# Altium project ET-COM.PrjPCB
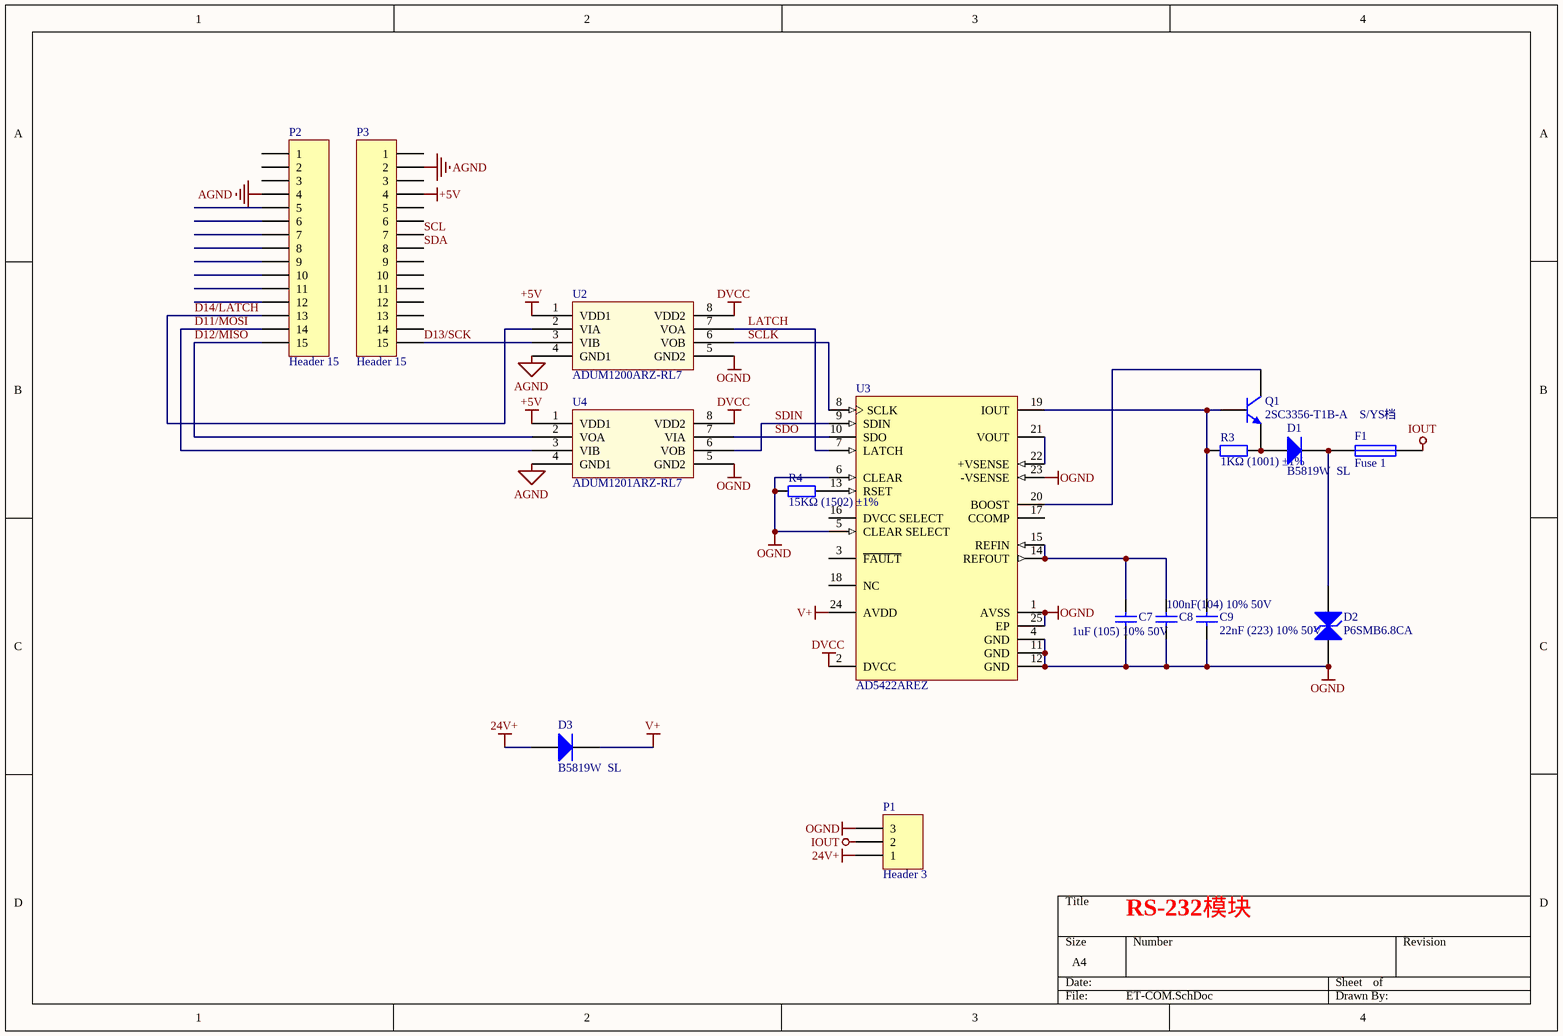
[diagram p0: ET-COM.SchDoc]
1 sheet, 16 parts. Net scope: global (net labels, ports and power ports of the same name join across sheets).
Board file: ET-COM.PcbDoc

## Sheet ET-COM.SchDoc
size A4

### Parts
C7  1uF (105) 10% 50V  [LC-0805_C]
C8  100nF(104) 10% 50V  [LC-0805_C]
C9  22nF (223) 10% 50V  [LC-0805_C]
D1  B5819W  SL  [LC-SOD-123]
D2  P6SMB6.8CA  [LC-SMB(DO-214AA)_S1]
D3  B5819W  SL  [SOD-123]
F1  Fuse 1  [LC-1206_L]
P1  Header 3  [connector_x3]
P2  Header 15  [HDR1X15]
P3  Header 15  [HDR1X15]
Q1  2SC3356-T1B-A    S/YS档  [LC-SOT-23(SOT-23-3)]
R3  1KΩ (1001) ±1%  [LC-0805_R]
R4  15KΩ (1502) ±1%  [LC-0805_R]
U2  ADUM1200ARZ-RL7  [LC-SOIC-8_150mil]
U3  AD5422AREZ  [RE-24_N]
U4  ADUM1201ARZ-RL7  [LC-SOIC-8_150mil]

### Nets
24V+: D3.1(A) P1.1
+5V: P3.4 U2.1(VDD1) U4.1(VDD1)
AGND: P2.4 P3.2 U2.4(GND1) U4.4(GND1)
DVCC: U2.8(VDD2) U3.2(DVCC) U4.8(VDD2)
IOUT: F1.2 P1.2
OGND: C7.1 C8.1 C9.1 D2.1(A) P1.3 R4.1 U2.5(GND2) U3.1(AVSS) U3.4(GND) U3.5(CLEAR_SELECT) U3.6(CLEAR) U3.11(GND) U3.12(GND) U3.23(-VSENSE) U3.25(EP) U4.5(GND2)
V+: D3.2(K) U3.24(AVDD)
D11/MOSI: P2.14 U4.3(VIB)
D12/MISO: P2.15 U4.2(VOA)
D13/SCK: P3.15 U2.3(VIB)
D14/LATCH: P2.13 U2.2(VIA)
LATCH: U2.7(VOA) U3.7(LATCH)
SCL: P3.7
SCLK: U2.6(VOB) U3.8(SCLK)
SDA: P3.8
SDIN: U3.9(SDIN) U4.6(VOB)
SDO: U3.10(SDO) U4.7(VIA)
NetC7_2: C7.2 C8.2 U3.14(REFOUT) U3.15(REFIN)
NetC9_2: C9.2 Q1.1(B) R3.1 U3.19(IOUT)
NetD1_1: D1.1(A) Q1.2(E) R3.2
NetD1_2: D1.2(K) D2.2(K) F1.1
NetQ1_3: Q1.3(C) U3.20(BOOST)
NetR4_2: R4.2 U3.13(RSET)
NetU3_21: U3.21(VOUT) U3.22(+VSENSE)

Not connected (* = marked no-connect by the designer): P2 1 2 3 5 6 7 8 9 10 11 12; P3 1 3 5 6 9 10 11 12 13 14; U3 3(~{FAULT}) 16(DVCC_SELECT) 17(CCOMP) 18(NC)

### Notes on the sheet
- RS-232模块

### Library data of the parts
C7 = 0805 1uF (105) 10% 50V: 贴片电容; ComponentLink1Description: 供应商链接; ComponentLink1URL: http://www.szlcsc.com/product/details_29074.html; Package: 0805; Supplier: LC; SuppliersPartNumber: C28323
C8 = 0805 100nF(104) 10% 50V: 贴片电容; ComponentLink1Description: 供应商链接; ComponentLink1URL: http://www.szlcsc.com/product/details_50686.html; Package: 0805; Supplier: LC; SuppliersPartNumber: C49678
C9 = 0805 22nF (223) 10% 50V: 贴片电容; ComponentLink1Description: 供应商链接; ComponentLink1URL: http://www.szlcsc.com/product/details_2081.html; Package: 0805; Supplier: LC; SuppliersPartNumber: C1729
D1 D3 = SOD-123 B5819W  SL: 肖特基二极管; ComponentLink1Description: 供应商链接; ComponentLink1URL: http://www.szlcsc.com/product/details_9093.html; Package: SOD-123; Supplier: LC; SuppliersPartNumber: C8598
D2 = SMB/DO-214AA P6SMB6.8CA: TVS; ComponentLink1Description: 供应商链接; ComponentLink1URL: http://www.szlcsc.com/product/details_79530.html; Package: SMB/DO-214AA; Supplier: LC; SuppliersPartNumber: C78395
F1 = Fuse 1: Fuse; Published: 8-Jun-2000; LatestRevisionDate: 17-Jul-2002; LatestRevisionNote: Re-released for DXP Platform.; PackageReference: PIN-W2/E2.8; Publisher: Altium Limited; PackageDescription: Thru-Hole; 2 Leads
P1 = Header 3: Header, 3-Pin; LatestRevisionDate: 17-Jul-2002; LatestRevisionNote: Re-released for DXP Platform.; Publisher: Altium Limited
P2 P3 = Header 15: Header, 15-Pin; LatestRevisionDate: 17-Jul-2002; LatestRevisionNote: Re-released for DXP Platform.; Publisher: Altium Limited
Q1 = SOT-23 2SC3356-T1B-A    S/YS档: 三极管; ComponentLink1Description: 供应商链接; ComponentLink1URL: http://www.szlcsc.com/product/details_10189.html; Package: SOT-23; Supplier: LC; SuppliersPartNumber: C9659
R3 = 0805 1KΩ (1001) 1%: 贴片电阻; ComponentLink1Description: 供应商链接; ComponentLink1URL: http://www.szlcsc.com/product/details_18201.html; Package: 0805; Supplier: LC; SuppliersPartNumber: C17513
R4 = 0805 15KΩ (1502) 1%: 贴片电阻; ComponentLink1Description: 供应商链接; ComponentLink1URL: http://www.szlcsc.com/product/details_18163.html; Package: 0805; Supplier: LC; SuppliersPartNumber: C17475
U2 U4 = ADUM1201ARZ-RL7: 隔离器; ComponentLink1Description: 供应商链接; ComponentLink1URL: http://www.szlcsc.com/product/details_10199.html; Package: SOIC-8_150mil; Supplier: LC; SuppliersPartNumber: C9669
U3 = AD5422AREZ: Single 16-Bit Current Source Digital-to-Analog Converter with Serial Interface and HART Connectivity, -40 to +85 degC, RE-24, Pb-Free, Tube; Generic Part Number: AD5422; Manufacturer: Analog Devices; # DAC Outputs: 1; Max V+: 40V; Op Pwr Diss: 158mW; Resolution (Bits): 16; Settling Time: 18祍; Single Supply: No; DatasheetVersion: Rev.E; PackageVersion: 050806-A; PackageReference: RE-24; PackageDescription: 24-Lead Thin Shrink Small Outline Package, Exposed Pad [TSSOP_EP]; Supplier 1: Digi-Key; Supplier Part Number 1: AD5422AREZ-ND; Supplier 2: Farnell; Supplier Part Number 2: 1827278; Supplier 3: Newark; Supplier Part Number 3: 51R0712; Supplier 4: Mouser; Supplier Part Number 4: 584-AD5422AREZ; Packing: Tube; RoHS: Y; Mounting Technology: Surface Mount; Code_JEDEC: MO-153-ADT; PartNumber: AD5422AREZ; ComponentLink1Description: Manufacturer URL; ComponentLink1URL: http://www.analog.com/en/index.html; ComponentLink2Description: Datasheet; ComponentLink2URL: http://www.analog.com/static/imported-files/data_sheets/AD5412_5422.pdf; ComponentLink3Description: Package Specification; ComponentLink3URL: http://www.analog.com/static/imported-files/packages/PKG_PDF/TSSOP_EP(RE)/RE_24.pdf; ComponentLink4Description: Product URL; ComponentLink4URL: http://www.analog.com/en/digital-to-analog-converters/da-converters/ad5422/products/product.html; ComponentLink5Description: Reference Design URL; ComponentLink5URL: http://www.analog.com/en/digital-to-analog-converters/da-converters/ad5422/products/product.html#prod_cross_sell